# Altium schematic sheet BatteryRegulators.SchDoc: Power Regulation
size Legal; DocumentNumber: 3; SheetNumber: 3; SheetTotal: 8; Project: Olympus
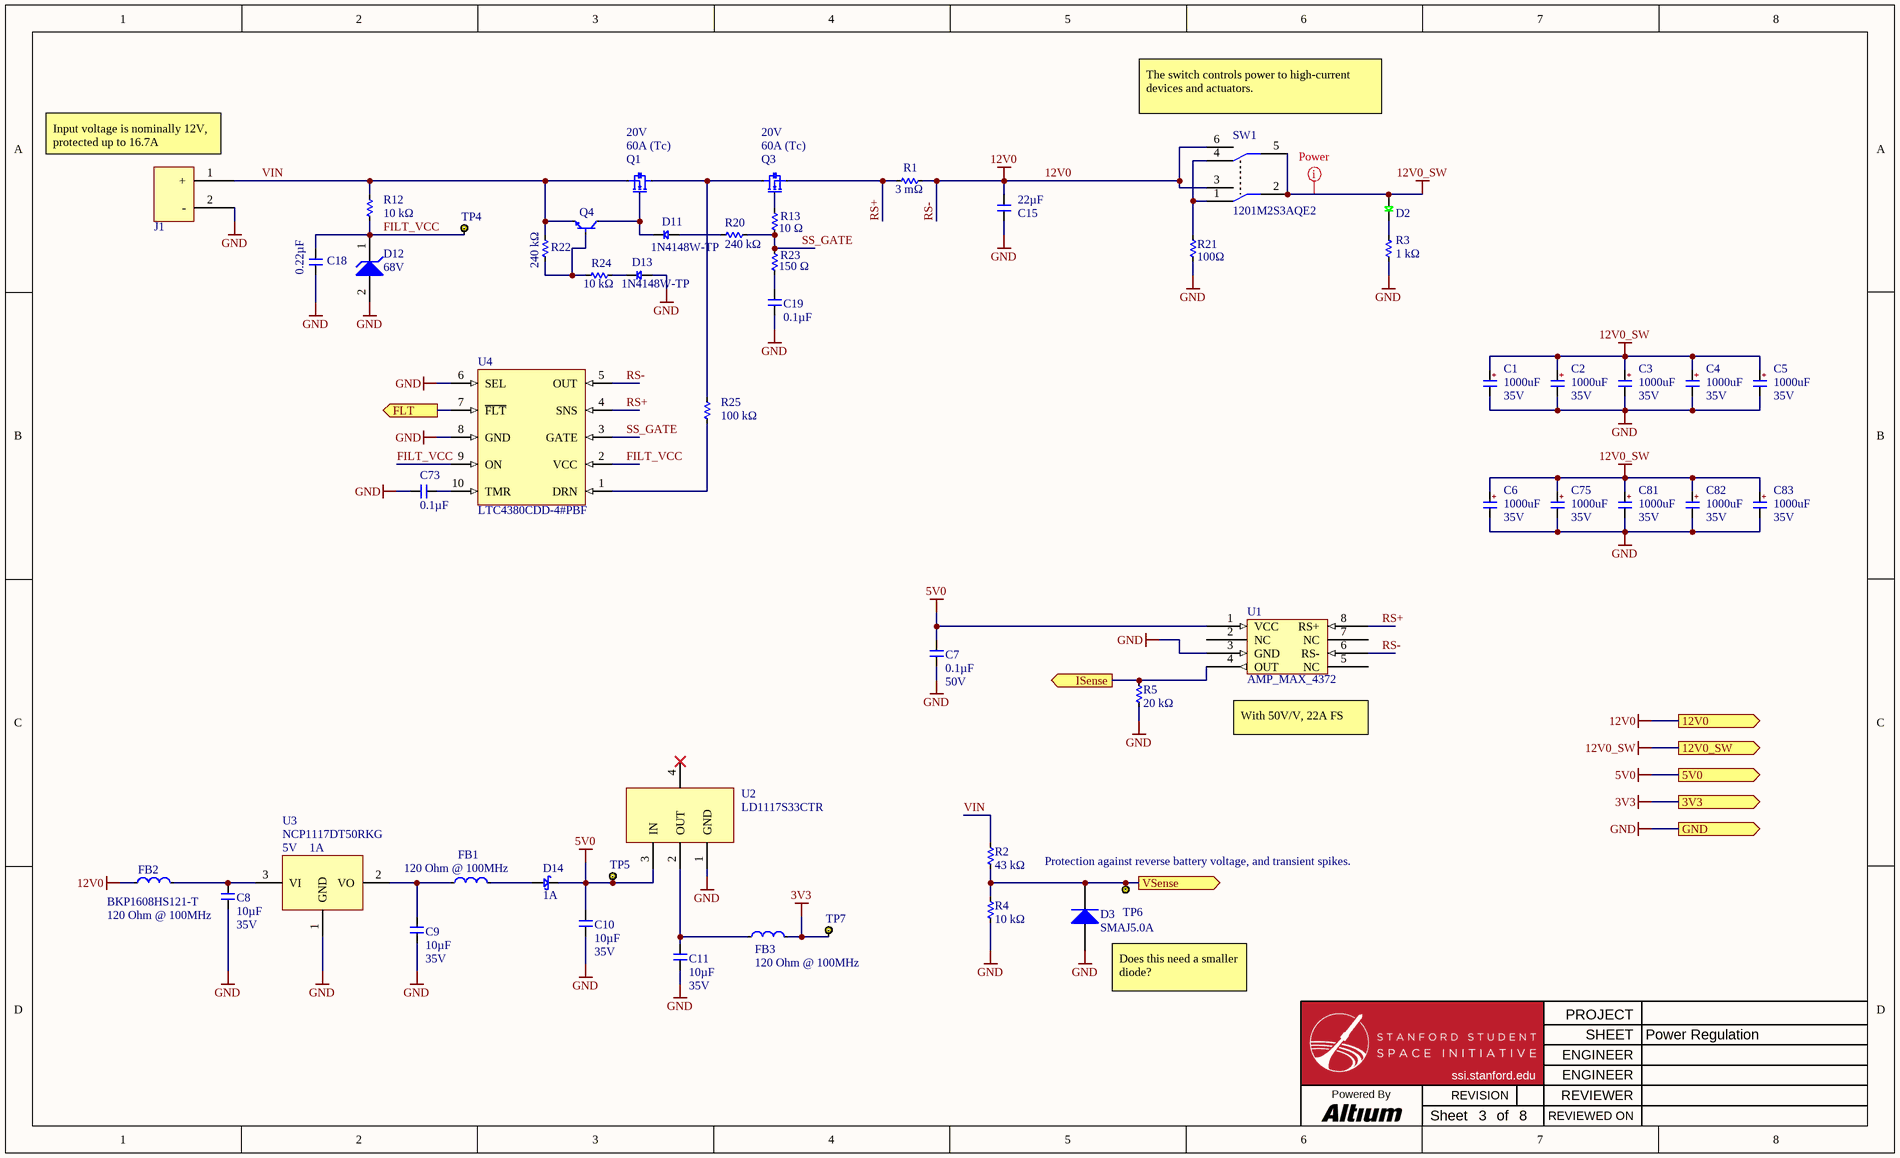
[diagram p0: BatteryRegulators.SchDoc]

## Parts
C1  value 1000uF  Rating: 35V  [ALUM_CAP_5mm-Leads]  (hidden comment: CAP_ALUM_1000uF_ECA-1VM102B)
C2  value 1000uF  Rating: 35V  [ALUM_CAP_5mm-Leads]  (hidden comment: CAP_ALUM_1000uF_ECA-1VM102B)
C3  value 1000uF  Rating: 35V  [ALUM_CAP_5mm-Leads]  (hidden comment: CAP_ALUM_1000uF_ECA-1VM102B)
C4  value 1000uF  Rating: 35V  [ALUM_CAP_5mm-Leads]  (hidden comment: CAP_ALUM_1000uF_ECA-1VM102B)
C5  value 1000uF  Rating: 35V  [ALUM_CAP_5mm-Leads]  (hidden comment: CAP_ALUM_1000uF_ECA-1VM102B)
C6  value 1000uF  Rating: 35V  [ALUM_CAP_5mm-Leads]  (hidden comment: CAP_ALUM_1000uF_ECA-1VM102B)
C7  Capacitance (shorthand): 0.1µF  Rated Voltage: 50V  [C0603]  (hidden comment: 490-1519-1-ND)
C8  Capacitance (shorthand): 10µF  Rated Voltage: 35V  [C0603]  (hidden comment: 490-13248-1-ND)
C9  Capacitance (shorthand): 10µF  Rated Voltage: 35V  [C0603]  (hidden comment: 490-13248-1-ND)
C10  Capacitance (shorthand): 10µF  Rated Voltage: 35V  [C0603]  (hidden comment: 490-13248-1-ND)
C11  Capacitance (shorthand): 10µF  Rated Voltage: 35V  [C0603]  (hidden comment: 490-13248-1-ND)
C15  Capacitance (shorthand): 22µF  [C0603]  (hidden comment: 1276-7076-1-ND)
C18  Capacitance (shorthand): 0.22µF  [C0603]  (hidden comment: 490-12546-1-ND)
C19  Capacitance (shorthand): 0.1µF  [C0603]  (hidden comment: 490-1519-1-ND)
C73  Capacitance (shorthand): 0.1µF  [C0603]  (hidden comment: 490-1519-1-ND)
C75  value 1000uF  Rating: 35V  [ALUM_CAP_5mm-Leads]  (hidden comment: CAP_ALUM_1000uF_ECA-1VM102B)
C81  value 1000uF  Rating: 35V  [ALUM_CAP_5mm-Leads]  (hidden comment: CAP_ALUM_1000uF_ECA-1VM102B)
C82  value 1000uF  Rating: 35V  [ALUM_CAP_5mm-Leads]  (hidden comment: CAP_ALUM_1000uF_ECA-1VM102B)
C83  value 1000uF  Rating: 35V  [ALUM_CAP_5mm-Leads]  (hidden comment: CAP_ALUM_1000uF_ECA-1VM102B)
D2  LED_C503B-GCS-CB0C0781  [LED_TH_5MM]  (value not drawn)
D3  SMAJ5.0A  [BOUR-SMA-2_V]
D11  Manufacturer Part Number: 1N4148W-TP  [SOD123]  (hidden comment: DIODE_1N4148WTPMSTR)
D12  Zener Voltage: 68V  [ONSC-SOD-123-2-425-04_V]  (hidden comment: MMSZ5266BT1G)
D13  Manufacturer Part Number: 1N4148W-TP  [SOD123]  (hidden comment: DIODE_1N4148WTPMSTR)
D14  Current - Average Rectified (Io): 1A  [SMA]  (hidden comment: Diode_CD214A-B1100LF)
FB1  Impedance @ Frequency: 120 Ohm @ 100MHz  [C0603]  (hidden comment: FB_120@100MHz_0603)
FB2  Manufacturer Part Number: BKP1608HS121-T  Impedance @ Frequency: 120 Ohm @ 100MHz  [C0603]  (hidden comment: FB_120@100MHz_0603)
FB3  Impedance @ Frequency: 120 Ohm @ 100MHz  [C0603]  (hidden comment: FB_120@100MHz_0603)
J1  XT60PW-M  [XT60PW-M-Footprint-1]  (value not drawn)
Q1  Drain to Source Voltage (Vdss): 20V  Current - Continuous Drain (Id) @ 25°C: 60A (Tc)  [POWERPAK_SO-8_SINGLE]  (hidden comment: NFET_SIR404DP-T1-GE3CT-ND)
Q3  Drain to Source Voltage (Vdss): 20V  Current - Continuous Drain (Id) @ 25°C: 60A (Tc)  [POWERPAK_SO-8_SINGLE]  (hidden comment: NFET_SIR404DP-T1-GE3CT-ND)
Q4  NPN_MMBT3904-7-F  [3SOT23]  (value not drawn)
R1  Resistance (Ohms): 3 mΩ  [R2512]  (hidden comment: TLRP3A20CR003FTDG)
R2  Resistance: 43 kΩ  [R0603]  (hidden comment: 311-43.0KHRCT-ND)
R3  Resistance: 1 kΩ  [R0603]  (hidden comment: 311-1.00KHRCT-ND)
R4  Resistance: 10 kΩ  [R0603]  (hidden comment: 311-10.0KHRCT-ND)
R5  Resistance: 20 kΩ  [R0603]  (hidden comment: 311-20.0KHRCT-ND)
R12  Resistance: 10 kΩ  [R0603]  (hidden comment: 311-10.0KHRCT-ND)
R13  Resistance: 10 Ω  [R0603]  (hidden comment: 311-10.0HRCT-ND)
R20  Resistance: 240 kΩ  [R0603]  (hidden comment: 311-240KHRCT-ND)
R21  Resistance: 100Ω  [R2512]  (hidden comment: RC2512JK-7W100RL)
R22  Resistance: 240 kΩ  [R0603]  (hidden comment: 311-240KHRCT-ND)
R23  Resistance: 150 Ω  [R0603]  (hidden comment: 311-150HRCT-ND)
R24  Resistance: 10 kΩ  [R0603]  (hidden comment: 311-10.0KHRCT-ND)
R25  Resistance: 100 kΩ  [R0603]  (hidden comment: 311-100KHRCT-ND)
SW1  1201M2S3AQE2  [1201M2S3AQE2-Footprint-1]
TP4  TEST_POINT_BLACK_KEYSTONE_5001  [TEST_POINT_BLACK_KEYSTONE_5001-Footprint-1]  (value not drawn)
TP5  TEST_POINT_BLACK_KEYSTONE_5001  [TEST_POINT_KEYSTONE_5001]  (value not drawn)
TP6  TEST_POINT_BLACK_KEYSTONE_5001  [TEST_POINT_BLACK_KEYSTONE_5001-Footprint-1]  (value not drawn)
TP7  TEST_POINT_BLACK_KEYSTONE_5001  [TEST_POINT_KEYSTONE_5001]  (value not drawn)
U1  AMP_MAX_4372  [8SOIC150]
U2  Manufacturer Part Number: LD1117S33CTR  [4SOT223]  (hidden comment: LDO_LD1117S33CTR)
U3  Manufacturer Part Number: NCP1117DT50RKG  Voltage - Output: 5V  Current - Output: 1A  [DPAK]  (hidden comment: LDO_NCP1117DT50RKG)
U4  LTC4380CDD-4#PBF  [SON50P300X75_HS-11N]

## Ports
3V3 (out), 5V0 (out), 12V0 (out), 12V0_SW (out), FLT (out), GND (out), ISense (out), VSense (out)

## Nets
3V3: FB3.2 TP7.1 ; port 3V3
5V0: C7.1 C10.1 D14.2(Cathode) TP5.1 U1.1(VCC) U2.3(IN) ; port 5V0
12V0: C15.1 FB2.1 R1.2 SW1.3 SW1.6 U1.6(RS-) U4.5(OUT) ; port 12V0  [also labelled RS-]
12V0_SW: C1.1(A) C2.1(A) C3.1(A) C4.1(A) C5.1(A) C6.1(A) C75.1(A) C81.1(A) C82.1(A) C83.1(A) D2.1(A) SW1.2 SW1.5 ; port 12V0_SW
GND: C1.2(C) C2.2(C) C3.2(C) C4.2(C) C5.2(C) C6.2(C) C7.2 C8.2 C9.2 C10.2 C11.2 C15.2 C18.2 C19.2 C73.1 C75.2(C) C81.2(C) C82.2(C) C83.2(C) D3.1(A) D12.2(A) D13.1 J1.2(-) R3.1 R4.1 R5.1 R21.1 U1.3(GND) U2.1(GND) U3.1(GND) U4.6(SEL) U4.8(GND) ; port GND
FILT_VCC: C18.1 D12.1(K) R12.1 TP4.1 U4.2(VCC) U4.9(ON)
FLT: U4.7(~{FLT}) ; port FLT
ISense: R5.2 U1.4(OUT) ; port ISense
RS+: Q3.3(S) R1.1 U1.8(RS+) U4.4(SNS)
SS_GATE: R13.1 R20.2 R23.2 U4.3(GATE)
VIN: J1.1(+) Q1.3(S) Q4.3(E) R2.2 R12.2 R22.2
VSense: D3.2(K) R2.1 R4.2 TP6.1 ; port VSense
NetC8_1: C8.1 FB2.2 U3.3(VI)
NetC9_1: C9.1 FB1.1 U3.2(VO)
NetC11_1: C11.1 FB3.1 U2.2(OUT)
NetC19_1: C19.1 R23.1
NetC73_2: C73.2 U4.10(TMR)
NetD2_2: D2.2(K) R3.2
NetD11_1: D11.1 R20.1
NetD11_2: D11.2 Q1.2(G) Q4.2(C)
NetD13_2: D13.2 R24.1
NetD14_1: D14.1(Anode) FB1.2
NetQ1_1: Q1.1(D) Q3.1(D) R25.2
NetQ3_2: Q3.2(G) R13.2
NetQ4_1: Q4.1(B) R22.1 R24.2
NetR21_2: R21.2 SW1.1 SW1.4
NetR25_1: R25.1 U4.1(DRN)

Not connected (* = marked no-connect by the designer): U1 2(NC) 5(NC) 7(NC); U2 4(GND)*

## Layout directives
mark named Power: 12V0_SW

## Notes on the sheet
- (near J1) Input voltage is nominally 12V, protected up to 16.7A
- (near SW1) The switch controls power to high-current devices and actuators.
- (near U1) With 50V/V, 22A FS
- (near TP6) Protection against reverse battery voltage, and transient spikes.
- Does this need a smaller diode?
- PROJECT
- SHEET
- Powered By
- Sheet
- of
- REVISION
- ssi.stanford.edu
- ENGINEER
- REVIEWER
- REVIEWED ON
- (in symbol CMP-026-0007-2) +

## Library data of the parts
C1-C6 C75 C81-C83 = CMP-026-0007-2: 1000uF (1mF) Electrolytic Capacitor in a 12.5mm x 20mm can package; Rule: UNIONINDEX=0|RULEKIND=PolygonConnect|NETSCOPE=AnyNet|LAYERKIND=SameLayer|NAME=Schematic Polygon Connect Style|CONNECTSTYLE=Direct|RELIEFCONDUCTORWIDTH=10mil|RELIEFENTRIES=4|POLYGONRELIEFANGLE=45 Angle|AIRGAPWIDTH=10mil|UNIT=Imperial; Design Item ID: CAP_ALUM_1000uF_ECA-1VM102B
C7 C19 C73 = CMP-119-0065-1: CAP CER 0603 0.1µF X7R 50V 10%; Manufacturer: Murata Electronics North America; Capacitance - pF (Machine readable): #NAME?; Dielectric: X7R
  C19 C73: Rated Voltage: 50V
C8-C11 = CMP-119-0071-1: CAP CER 10UF 35V X5R 0603 20%; Manufacturer: Murata Electronics North America; Capacitance - pF (Machine readable): #NAME?; Dielectric: X5R
C15 = CMP-119-0072-1: CAP CER 22UF 16V X5R 0603 20%; Manufacturer: Samsung Electro-Mechanics; Capacitance - pF (Machine readable): #NAME?; Rated Voltage: 16V; Dielectric: X5R
C18 = CMP-119-0067-1: CAP CER 0603 0.22µF X7R 50V 10%; Manufacturer: Murata Electronics North America; Capacitance - pF (Machine readable): #NAME?; Rated Voltage: 50V; Dielectric: X7R
D2 = CMP-033-0070-3: LED GREEN CLEAR 5MM ROUND T/H; Manufacturer: Cree; Lens Colour: Colorless; Luminous Intensity: 24850mcd; Viewing Angle: 30°; Forward Current: 20mA; Forward Voltage: 3.2V; Lens Style: Dome; Dominant Wavelength: 527nm; Power Rating: 120mW; Reverse Voltage (DC): 5V; Number of LEDs: 1; Manufacturer Part Number: C503B-GCS-CB0C0781; Stock 1: 191; Pricing 1: 1=0.25, 10=0.236, 100=0.2184, 1000=0.1954, 50000=0.1814 (USD); Mount: Through Hole; Case/Package: Radial; Colour: Green; Min Operating Temperature: -40°C; Max Operating Temperature: 95°C; Illumination Colour: Green; Packaging: Bulk; Package Quantity: 500; Lens Transparency: Clear; Test Current: 20mA; Wavelength: 527nm; Length: 5.8mm; Height: 12.7mm; Width: 5mm; ComponentLink1URL: http://www.mouser.com/ds/2/90/cree.C503B%20BAS%20BAN%20BCS%20BCN%20GAS%20GAN%20GCS%20GCN%201094[1]-310350.pdf; ComponentLink1Description: http://www.mouser.com/ds/2/90/cree.C503B%20BAS%20BAN%20BCS%20BCN%20GAS%20GAN%20GCS%20GCN%201094[1]-310350.pdf; ComponentLink2URL: http://www.cree.com/led-components/media/documents/C503B-BAS-BAN-BCS-BCN-GAS-GAN-GCS-GCN-1094.pdf; ComponentLink2Description: http://www.cree.com/led-components/media/documents/C503B-BAS-BAN-BCS-BCN-GAS-GAN-GCS-GCN-1094.pdf; Design Item ID: LED_C503B-GCS-CB0C0781; Source: diode.SchLib
D3 = CMP-00017-1: BOURNS - SMAJ5.0A - TVS Diode, SMAJ Series, Unidirectional, 5 V, 9.2 V, DO-214AC (SMA), 2 Pins; Min Breakdown Voltage: 6.4V; ESD Protection: Yes; Test Current: 10mA; Clamping Voltage: 9.2V; Leakage Current: 800uA; Max Breakdown Voltage: 7V; Number of Unidirectional Channels: 1; Operating Supply Voltage: 3.5V; Peak Pulse Current: 43.5A; Power Line Protection: No; Peak Pulse Power: 400W; Reverse Standoff Voltage: 5V; Diode Type: ZENER; Element Configuration: Single; Max Surge Current: 40A; Height: 2.42mm; Case/Package: DO-214AC; Max Reverse Leakage Current: 800uA; Packaging: Tape and Reel; REACH SVHC: No SVHC; Direction: Unidirectional; Series: SMAJ; Radiation Hardening: No; Mount: Surface Mount; Max Operating Temperature: 150°C; Package Quantity: 1; Width: 2.92mm; Reverse Breakdown Voltage: 6.4V; Number of Channels: 1; Polarity: Unidirectional; Min Operating Temperature: -55°C; Length: 4.57mm; Resistor Type: Zener; Max Power Dissipation: 400W; Number of Pins: 2; Breakdown Voltage: 7V; Number of Elements: 1; Termination: SMD/SMT
D11 D13 = CMP-033-0052-1: DIODE SWITCH 100V 150MA SOD123; Manufacturer: Micro Commercial Co; Voltage - Forward (Vf) (Max) @ If: 1.25V @ 150mA; Capacitance @ Vr, F: 2pF @ 0V, 1MHz; Diode Type: Standard; Reverse Recovery Time (trr): 4ns; Current - Reverse Leakage @ Vr: 1µA @ 75V; Speed: Small Signal =< 200mA (Io), Any Speed; Voltage - DC Reverse (Vr) (Max): 100V; Stock 1: 145222; Supplier Device Package: SOD-123; Packaging: Cut Tape (CT); Package / Case: SOD-123; Mounting Type: Surface Mount; Design Item ID: DIODE_1N4148WTPMSTR; RoHS: RoHS Compliant; Current - Average Rectified (Io): 150mA; ComponentLink1URL: http://61.222.192.61/mccsemi/up_pdf/1N4148W(SOD123).pdf; Source: diode.SchLib; Pricing 1: 1=0.31, 10=0.202, 25=0.132, 100=0.088, 250=0.0572, 500=0.04048, 1000=0.0286 (USD); ComponentLink1Description: http://61.222.192.61/mccsemi/up_pdf/1N4148W(SOD123).pdf
D12 = CMP-00027-1: DIODE ZENER 68V 500MW SOD123 / Zener Diode Single 68V 5% 230Ohm 500mW 2-Pin SOD-123 T/R; Zener Current: 10mA; Max Reverse Current: 100nA; Breakdown Voltage: 71.4V; Impedance: 230R; Material: Plastic; Forward Voltage: 900mV; Test Current: 1.8mA; Packaging: Tape and Reel; Number of Pins: 2; Tolerance: 5%; Max Power Dissipation: 500mW; Element Configuration: Single; Min Operating Temperature: -55°C; Width: 1.6mm; REACH SVHC: No SVHC; Voltage Rating (DC): 68V; Case/Package: SOD-123-2; Package Quantity: 1; Length: 2.69mm; RoHS Compliant: Yes; Max Operating Temperature: 150°C; Power Rating: 500mW; Working Voltage: 68V; Max Reverse Leakage Current: 100nA; Power Dissipation: 500mW; Lead Free: Lead Free; Voltage Tolerance: 5%; Radiation Hardening: No; Height: 1.12mm
D14 = CMP-033-0060-1: Diode Schottky 100V 1A Surface Mount SMA (DO-214AC); Manufacturer: Bourns Inc.; Voltage - Forward (Vf) (Max) @ If: 790mV @ 1A; Current - Reverse Leakage @ Vr: 500µA @ 100V; Speed: Fast Recovery =< 500ns, > 200mA (Io); Capacitance @ Vr, F: 30pF @ 4V, 1MHz; Design Item ID: Diode_CD214A-B1100LF; Part Status: Active; Source: diode.SchLib; Stock 1: 21982; Manufacturer Part Number: CD214A-B1100LF; Diode Type: Schottky; Voltage - DC Reverse (Vr) (Max): 100V; Reverse Recovery Time (trr): -; Operating Temperature - Junction: -55°C ~ 125°C; RoHS: RoHS Compliant; Supplier Device Package: SMA (DO-214AC); Package / Case: DO-214AC, SMA; Packaging: Cut Tape (CT); ComponentLink1Description: http://www.bourns.com/docs/Product-Datasheets/CD214-B120_B1100.pdf; Mounting Type: Surface Mount; Pricing 1: 1=0.54, 10=0.42, 25=0.3544, 100=0.2888, 250=0.2392, 500=0.1976, 1000=0.148, 2500=0.136 (USD); ComponentLink1URL: http://www.bourns.com/docs/Product-Datasheets/CD214-B120_B1100.pdf
FB1 FB3 = CMP-051-0015-1: FERRITE BEAD 120 OHM @ 100 MHz; Manufacturer: Taiyo Yuden; Manufacturer Part Number: BKP1608HS121-T; Filter Type: Power Line; Number of Lines: 1; Current Rating (Max): 2.7A; DC Resistance (DCR) (Max): 35 mOhm; RoHS: RoHS Compliant; Stock 1: 47959; Pricing 1: 1=0.1, 10=0.059, 25=0.052, 50=0.0474, 100=0.0426, 250=0.0312, 500=0.0227, 1000=0.02223 (USD); Packaging: Cut Tape (CT); Part Status: Active; Ratings: -; Operating Temperature: -55°C ~ 85°C; Package / Case: 0603 (1608 Metric); Mounting Type: Surface Mount; Height (Max): 0.037" (0.95mm); Size / Dimension: 0.063" L x 0.031" W (1.60mm x 0.80mm); ComponentLink1URL: http://ds.yuden.co.jp/TYCOMPAS/ut/detail.do?productNo=BKP1608HS121-T&fileName=BKP1608HS121-T_SS&mode=specSheetDownload; ComponentLink1Description: http://ds.yuden.co.jp/TYCOMPAS/ut/detail.do?productNo=BKP1608HS121-T&fileName=BKP1608HS121-T_SS&mode=specSheetDownload; Design Item ID: FB_120@100MHz_0603; Source: inductor.SchLib
FB2 = CMP-051-0015-1: FERRITE BEAD 120 OHM @ 100 MHz; Manufacturer: Taiyo Yuden; Filter Type: Power Line; Number of Lines: 1; Current Rating (Max): 2.7A; DC Resistance (DCR) (Max): 35 mOhm; RoHS: RoHS Compliant; Stock 1: 47959; Pricing 1: 1=0.1, 10=0.059, 25=0.052, 50=0.0474, 100=0.0426, 250=0.0312, 500=0.0227, 1000=0.02223 (USD); Packaging: Cut Tape (CT); Part Status: Active; Ratings: -; Operating Temperature: -55°C ~ 85°C; Package / Case: 0603 (1608 Metric); Mounting Type: Surface Mount; Height (Max): 0.037" (0.95mm); Size / Dimension: 0.063" L x 0.031" W (1.60mm x 0.80mm); ComponentLink1URL: http://ds.yuden.co.jp/TYCOMPAS/ut/detail.do?productNo=BKP1608HS121-T&fileName=BKP1608HS121-T_SS&mode=specSheetDownload; ComponentLink1Description: http://ds.yuden.co.jp/TYCOMPAS/ut/detail.do?productNo=BKP1608HS121-T&fileName=BKP1608HS121-T_SS&mode=specSheetDownload; Design Item ID: FB_120@100MHz_0603; Source: inductor.SchLib
J1 = CMP-00029-2: XT60 Sink, Right Angle; Rule: UNIONINDEX=0|RULEKIND=PolygonConnect|NETSCOPE=AnyNet|LAYERKIND=SameLayer|NAME=Schematic Polygon Connect Style|CONNECTSTYLE=Direct|RELIEFCONDUCTORWIDTH=10mil|RELIEFENTRIES=4|POLYGONRELIEFANGLE=45 Angle|AIRGAPWIDTH=10mil|UNIT=Imperial
Q1 Q3 = CMP-078-0060-2: MOSFET N-CH 20V 60A POWERPAK1212-8; Manufacturer: Vishay Siliconix; Power - Max: 104W; FET Feature: Standard; FET Type: MOSFET N-Channel, Metal Oxide; Vgs(th) (Max) @ Id: 1.5V @ 250µA; Gate Charge (Qg) @ Vgs: 97nC @ 4.5V; Input Capacitance (Ciss) @ Vds: 8130pF @ 10V; Rds On (Max) @ Id, Vgs: 1.6 mOhm @ 20A, 10V; Rule: UNIONINDEX=0|RULEKIND=PolygonConnect|NETSCOPE=AnyNet|LAYERKIND=SameLayer|NAME=Schematic Polygon Connect Style|CONNECTSTYLE=Direct|RELIEFCONDUCTORWIDTH=10mil|RELIEFENTRIES=4|POLYGONRELIEFANGLE=45 Angle|AIRGAPWIDTH=10mil|UNIT=Imperial; Operating Temperature: -55°C ~ 150°C (TJ); Design Item ID: NFET_SIR404DP-T1-GE3CT-ND; Source: transistor_fet.SchLib; ComponentLink1Description: http://www.vishay.com/docs/64815/sir404dp.pdf; ComponentLink1URL: http://www.vishay.com/docs/64815/sir404dp.pdf; RoHS: RoHS Compliant; Pricing 1: 1=1.98, 10=1.775, 100=1.4235, 500=1.17, 1000=0.9685 (USD); Mounting Type: Surface Mount; Package / Case: PowerPAK® SO-8; Packaging: Cut Tape (CT); Manufacturer Part Number: SIR404DP-T1-GE3; Supplier Device Package: PowerPAK® SO-8; Stock 1: 5696
Q4 = CMP-076-0004-1: TRANS NPN 40V 0.2A SMD SOT23-3; Manufacturer: Diodes Incorporated; Frequency - Transition: 300MHz; Current - Collector Cutoff (Max): 50nA (ICBO); Power - Max: 300mW; Current - Collector (Ic) (Max): 200mA; Vce Saturation (Max) @ Ib, Ic: 300mV @ 5mA, 50mA; DC Current Gain (hFE) (Min) @ Ic, Vce: 100 @ 10mA, 1V; Package / Case: TO-236-3, SC-59, SOT-23-3; Packaging: Cut Tape (CT); Mounting Type: Surface Mount; Supplier Device Package: SOT-23-3; Source: transistor_bjt.SchLib; Stock 1: 600097; Pricing 1: 1=0.12, 10=0.108, 100=0.0589, 500=0.03626, 1000=0.02472 (USD); Voltage - Collector Emitter Breakdown (Max): 40V; Transistor Type: NPN; ComponentLink1URL: http://www.diodes.com/_files/datasheets/ds30036.pdf; Part Status: Active; ComponentLink1Description: http://www.diodes.com/_files/datasheets/ds30036.pdf; RoHS: RoHS Compliant; Operating Temperature: -55°C ~ 150°C (TJ); Manufacturer Part Number: MMBT3904-7-F; Design Item ID: NPN_MMBT3904-7-F
R1 = CMP-069-0049-1: Res Current Sense Metal Strip 2512 0.003 Ohm 1% 2W ±25ppm/°C Molded Emboss T/R; Rule: UNIONINDEX=0|RULEKIND=PolygonConnect|NETSCOPE=AnyNet|LAYERKIND=SameLayer|NAME=Schematic Polygon Connect Style|CONNECTSTYLE=Direct|RELIEFCONDUCTORWIDTH=10mil|RELIEFENTRIES=4|POLYGONRELIEFANGLE=45 Angle|AIRGAPWIDTH=10mil|UNIT=Imperial
R2 = CMP-126-0343-2: RES SMD 43K OHM 1% 1/10W 0603; Manufacturer Part Number: RC0603FR-0743KL; Manufacturer: Yageo; Power (Watts): 0.1W, 1/10W; Resistance (Sortable): 43000; Temperature Coefficient: ±100ppm/°C; Tolerance: ±1%; Image: //media.digikey.com/Renders/Yageo%20Renders/0603-(1608-Metric).jpg; Datasheets: http://www.yageo.com/documents/recent/PYu-RC_Group_51_RoHS_L_9.pdf; Operating Temperature: -55°C ~ 155°C
R3 = CMP-126-0172-2: RES SMD 1K OHM 1% 1/10W 0603; Manufacturer: Yageo; Manufacturer Part Number: RC0603FR-071KL; Power (Watts): 0.1W, 1/10W; Resistance (Sortable): 1000; Temperature Coefficient: ±100ppm/°C; Image: //media.digikey.com/Renders/Yageo%20Renders/0603-(1608-Metric).jpg; Operating Temperature: -55°C ~ 155°C; Tolerance: ±1%; Datasheets: http://www.yageo.com/documents/recent/PYu-RC_Group_51_RoHS_L_9.pdf
R4 = CMP-126-0273-2: RES SMD 10K OHM 1% 1/10W 0603; Manufacturer Part Number: RC0603FR-0710KL; Manufacturer: Yageo; Resistance (Sortable): 10000; Power (Watts): 0.1W, 1/10W; Temperature Coefficient: ±100ppm/°C; Datasheets: http://www.yageo.com/documents/recent/PYu-RC_Group_51_RoHS_L_9.pdf; Image: //media.digikey.com/Renders/Yageo%20Renders/0603-(1608-Metric).jpg; Tolerance: ±1%; Operating Temperature: -55°C ~ 155°C
R5 = CMP-126-0304-2: RES SMD 20K OHM 1% 1/10W 0603; Manufacturer Part Number: RC0603FR-0720KL; Manufacturer: Yageo; Resistance (Sortable): 20000; Power (Watts): 0.1W, 1/10W; Temperature Coefficient: ±100ppm/°C; Datasheets: http://www.yageo.com/documents/recent/PYu-RC_Group_51_RoHS_L_9.pdf; Image: //media.digikey.com/Renders/Yageo%20Renders/0603-(1608-Metric).jpg; Tolerance: ±1%; Operating Temperature: -55°C ~ 155°C
R12 R24 = CMP-126-0273-2: RES SMD 10K OHM 1% 1/10W 0603; Manufacturer: Yageo; Manufacturer Part Number: RC0603FR-0710KL; Power (Watts): 0.1W, 1/10W; Resistance (Sortable): 10000; Temperature Coefficient: ±100ppm/°C; Tolerance: ±1%; Datasheets: http://www.yageo.com/documents/recent/PYu-RC_Group_51_RoHS_L_9.pdf; Image: //media.digikey.com/Renders/Yageo%20Renders/0603-(1608-Metric).jpg; Operating Temperature: -55°C ~ 155°C
R13 = CMP-126-0002-2: RES SMD 10 OHM 1% 1/10W 0603; Manufacturer: Yageo; Manufacturer Part Number: RC0603FR-0710RL; Temperature Coefficient: ±200ppm/°C; Resistance (Sortable): 10; Power (Watts): 0.1W, 1/10W; Tolerance: ±1%; Operating Temperature: -55°C ~ 155°C; Image: //media.digikey.com/Renders/Yageo%20Renders/0603-(1608-Metric).jpg; Datasheets: http://www.yageo.com/documents/recent/PYu-RC_Group_51_RoHS_L_9.pdf
R20 R22 = CMP-126-0419-2: RES SMD 240K OHM 1% 1/10W 0603; Manufacturer Part Number: RC0603FR-07240KL; Manufacturer: Yageo; Resistance (Sortable): 240000; Power (Watts): 0.1W, 1/10W; Temperature Coefficient: ±100ppm/°C; Datasheets: http://www.yageo.com/documents/recent/PYu-RC_Group_51_RoHS_L_9.pdf; Tolerance: ±1%; Image: //media.digikey.com/Renders/Yageo%20Renders/0603-(1608-Metric).jpg; Operating Temperature: -55°C ~ 155°C
R21 = CMP-00024-1: Res Thick Film 2512 100 Ohm 5% 1W ±100ppm/°C Molded SMD SMD Embossed T/R; Voltage Rating: 200V; Temperature Coefficient: 200ppm/°C; Rule: UNIONINDEX=0|RULEKIND=PolygonConnect|NETSCOPE=AnyNet|LAYERKIND=SameLayer|NAME=Schematic Polygon Connect Style|CONNECTSTYLE=Direct|RELIEFCONDUCTORWIDTH=10mil|RELIEFENTRIES=4|POLYGONRELIEFANGLE=45 Angle|AIRGAPWIDTH=10mil|UNIT=Imperial; Case Code (Metric): 6432; Resistance Tolerance: 5%; Case/Package: 2512; Power Rating: 1W; Military Standard: Not; REACH SVHC: Unknown; Construction: Rectangular; Length: 6.35mm; Tolerance: 5%; Case Code (Imperial): 2512; RoHS Compliant: Yes; Packaging: Cut Tape; Contact Plating: Tin,Matte; Resistor Type: Thick Film; Radiation Hardening: No; Lead Free: Lead Free; Max Operating Temperature: 155°C; Size Code: 2512; Depth: 3.1mm; Min Operating Temperature: -55°C
R23 = CMP-126-0085-2: RES SMD 150 OHM 1% 1/10W 0603; Manufacturer Part Number: RC0603FR-07150RL; Manufacturer: Yageo; Resistance (Sortable): 150; Power (Watts): 0.1W, 1/10W; Temperature Coefficient: ±100ppm/°C; Operating Temperature: -55°C ~ 155°C; Datasheets: http://www.yageo.com/documents/recent/PYu-RC_Group_51_RoHS_L_9.pdf; Tolerance: ±1%; Image: //media.digikey.com/Renders/Yageo%20Renders/0603-(1608-Metric).jpg
R25 = CMP-126-0382-2: RES SMD 100K OHM 1% 1/10W 0603; Manufacturer: Yageo; Manufacturer Part Number: RC0603FR-07100KL; Power (Watts): 0.1W, 1/10W; Resistance (Sortable): 100000; Temperature Coefficient: ±100ppm/°C; Image: //media.digikey.com/Renders/Yageo%20Renders/0603-(1608-Metric).jpg; Operating Temperature: -55°C ~ 155°C; Tolerance: ±1%; Datasheets: http://www.yageo.com/documents/recent/PYu-RC_Group_51_RoHS_L_9.pdf
SW1 = CMP-00028-1: Switch Slide ON None ON DPDT Side Slide 6A 250VAC 28VDC PC Pins Bracket Mount/Through Hole; Max Voltage Rating (DC): 28V; Insulation Resistance: 1GR; Actuator Color: Black; Max Voltage Rating (AC): 250V; Actuator Length: 4.72mm; Switch Function: On-On; Switch Travel: 2.16mm; Voltage Rating (AC): 120V; Electrical Life: 40000Cycles; Actuator Material: Nylon,Polyamide; Actuator Type: Standard; Rule: UNIONINDEX=0|RULEKIND=PolygonConnect|NETSCOPE=AnyNet|LAYERKIND=SameLayer|NAME=Schematic Polygon Connect Style|CONNECTSTYLE=Direct|RELIEFCONDUCTORWIDTH=10mil|RELIEFENTRIES=4|POLYGONRELIEFANGLE=45 Angle|AIRGAPWIDTH=10mil|UNIT=Imperial; Contact Current Rating: 6A; Voltage Rating (DC): 28V; Contact Plating: Silver; Length: 13.57mm; Min Operating Temperature: -30°C; REACH SVHC: No SVHC; Depth: 22.49mm; Packaging: Bulk; Throw Configuration: DPDT; Termination: PC Pins; Max Current Rating: 6A; Current Rating: 6A; Flammability Rating: UL94 V-0; Series: 1000; Contact Material: Copper,Silver; Radiation Hardening: No; RoHS Compliant: No; Max Operating Temperature: 65°C; Housing Material: Stainless Steel; Orientation: Horizontal; Package Quantity: 1; Lead Free: Lead Free; Mount: Through Hole,Brackets
TP4-TP7 = CMP-055-0004-2: BLACK T/H TEST POINT; Manufacturer Part Number: 5001; Manufacturer: Keystone Electronics; Material - Body: Phosphor Bronze; Material - Insulation: Nylon 46, UL 94V-0; Plating: Silver; ComponentLink1Description: http://www.keyelco.com/product-pdf.cfm?p=1310; Source: mechanical.SchLib; Part Status: Active; Stock 1: 718799; RoHS: RoHS Compliant; Packaging: Bulk; Mounting Type: 0.040" (1.02mm) Hole Diameter; ComponentLink1URL: http://www.keyelco.com/product-pdf.cfm?p=1310; Pricing 1: 1=0.37, 10=0.316, 50=0.2298, 100=0.2209, 250=0.19832, 500=0.18932, 1000=0.1616, 2500=0.14424, 5000=0.13523 (USD); Size / Dimension: 0.100" Dia x 0.180" L (2.54mm x 4.57mm); Color: Black; Design Item ID: TEST_POINT_BLACK_KEYSTONE_5001
U1 = CMP-038-0006-2: Low-Cost, UCSP/SOT23, Micropower, High-Side Current-Sense Amplifier with Voltage; -3db Bandwidth: 200kHz; Bandwidth: 275kHz; Common Mode Rejection Ratio: 85dB; Min Supply Voltage: 2.7V; Power Supply Rejection Ratio (PSRR): 75dB; Number of Elements: 1; Input Bias Current: 2uA; Nominal Supply Current: 30uA; Max Supply Current: 60uA; Voltage Gain: 33.98dB; Max Supply Voltage: 28V; Power Dissipation: 471mW; Input Offset Voltage (Vos): 300uV; Source: ic_analog.SchLib; Design Item ID: AMP_MAX_4372; Radiation Hardening: No; Series: MAX4372F; Number of Pins: 8; Number of Amplifiers: 1; Number of Channels: 1; Operating Supply Current: 30uA; Width: 4mm; Supply Current: 30uA; Height: 1.5mm; Case/Package: SOIC; Length: 5mm; RoHS Compliant: Yes; Package Quantity: 100; Min Operating Temperature: -40°C; Packaging: Rail/Tube; Number of Circuits: 1; REACH SVHC: Unknown; Max Operating Temperature: 85°C; Lead Free: Lead Free
U2 = CMP-048-0040-1: IC VOLTAGE REG 3.3V 800MA SOT223 INDUSTRIAL TEMP; Manufacturer: STMicroelectronics; Regulator Topology: Positive Fixed; Voltage - Dropout (Typical): 1.1V @ 800mA; Number of Regulators: 1; Voltage - Input: Up to 15V; RoHS: RoHS Compliant; Stock 1: 63873; Pricing 1: 1=0.46, 10=0.373, 100=0.2538, 500=0.19034, 1000=0.14276 (USD); Packaging: Cut Tape (CT); Part Status: Active; Voltage - Output: 3.3V; Current - Output: 800mA; Current - Limit (Min): -; Operating Temperature: -40°C ~ 125°C; Mounting Type: Surface Mount; Package / Case: TO-261-4, TO-261AA; Supplier Device Package: SOT-223; ComponentLink1URL: http://www.st.com/content/ccc/resource/technical/document/datasheet/99/3b/7d/91/91/51/4b/be/CD00000544.pdf/files/CD00000544.pdf/jcr:content/translations/en.CD00000544.pdf; ComponentLink1Description: http://www.st.com/content/ccc/resource/technical/document/datasheet/99/3b/7d/91/91/51/4b/be/CD00000544.pdf/files/CD00000544.pdf/jcr:content/translations/en.CD00000544.pdf; Design Item ID: LDO_LD1117S33CTR; Source: ic_pmic.SchLib
U3 = CMP-048-0060-1: IC REG LDO 5V 1A DPAK; Manufacturer: ON Semiconductor; Regulator Topology: Positive Fixed; Voltage - Dropout (Typical): 1.07V @ 800mA; Number of Regulators: 1; Voltage - Input: Up to 20V; RoHS: RoHS Compliant; Stock 1: 1849; Pricing 1: 1=0.46, 10=0.391, 100=0.2919, 500=0.22932, 1000=0.17721 (USD); Packaging: Cut Tape (CT); Part Status: Active; Current - Limit (Min): 1A; Operating Temperature: 0°C ~ 125°C; Mounting Type: Surface Mount; Package / Case: TO-252-3, DPak (2 Leads + Tab), SC-63; Supplier Device Package: DPAK-3; ComponentLink1URL: http://www.onsemi.com/pub_link/Collateral/NCP1117-D.PDF; ComponentLink1Description: http://www.onsemi.com/pub_link/Collateral/NCP1117-D.PDF; Source: ic_pmic.SchLib; Design Item ID: LDO_NCP1117DT50RKG
U4 = CMP-00023-2: Hot-swap Controller, 72V, DFN-10; Min Supply Voltage: 4V; Number of Circuits: 1; Clamping Voltage: 13.5V; Min Operating Temperature: 0°C; RoHS Compliant: Yes; Max Supply Voltage: 72V; Case/Package: DFN; Number of Pins: 10; Packaging: Rail/Tube; Max Operating Temperature: 70°C; Working Voltage: 72V; REACH SVHC: No SVHC